# EAGLE design IDC-RJ45_connector_v1 (EAGLE 7.6.0)
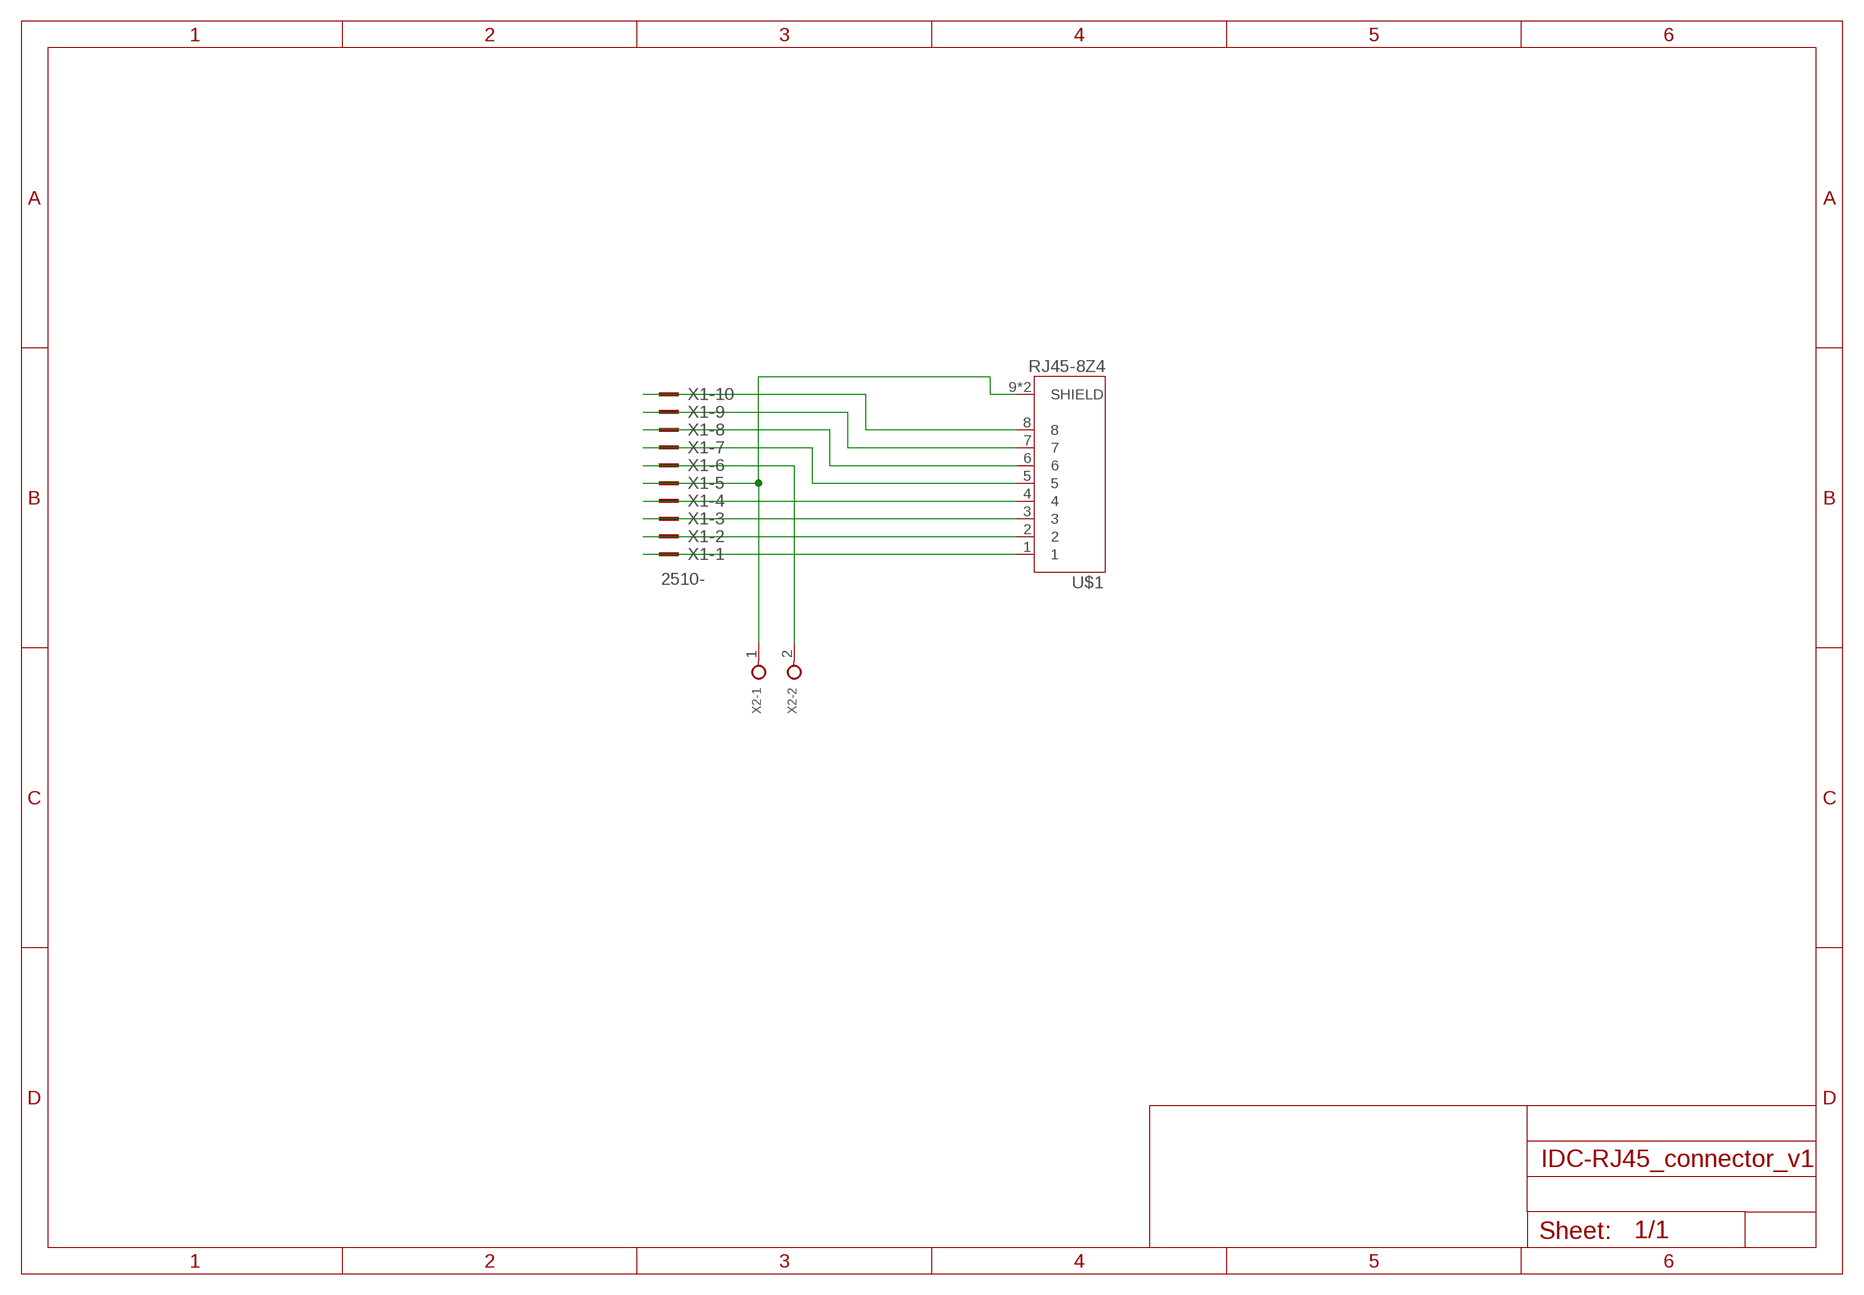
[diagram p0: schematic, sheet 1]

## Parts
U$1  RJ45-8Z4  [TE_RJ45-8Z4]
X1  2510-  [PAK100/2500-10]
X2  TERMINAL-5MM-2POLE  [TERMINAL_2P_5MM]

## Nets
GND [pwr]: U$1.9(SHIELD) U$1.10(SHIELD) X1.5 X2.1
N$1: U$1.1 X1.1
N$2: U$1.2 X1.2
N$3: U$1.3 X1.3
N$4: U$1.4 X1.4
N$5: U$1.5 X1.7
N$6: U$1.6 X1.8
N$7: U$1.7 X1.9
N$8: U$1.8 X1.10
VCC [pwr]: X1.6 X2.2

## Library data of the parts
U$1 = Thomas:RJ45-8Z4: CONN MOD JACK 8P8C R/A SHIELDED Check availability <https://pricing.snapeda.com/parts/RJ45-8Z4/TE%20Connectivity/view-part?ref=eda>; AVAILABILITY: In Stock; DESCRIPTION: Jack Modular Connector 8p8c (RJ45, Ethernet) 90° Angle (Right) Shielded -; MF: TE Connectivity; MP: RJ45-8Z4; PACKAGE: None; PRICE: None; PURCHASE-URL: https://pricing.snapeda.com/search/part/RJ45-8Z4/?ref=eda
X1 = Thomas:2510-: 3M (TM) Pak 100 4-Wall Header Source: 3M; MF: 3M; MPN: 2510-6002UB; OC_FARNELL: 9838244; OC_NEWARK: 46F4725
X2 = Thomas:TERMINAL-5MM-2POLE: WAGO SCREW CLAMP; OC_FARNELL: unknown; OC_NEWARK: unknown

## Net classes
1 pwr: width 0.61 mm

## Board
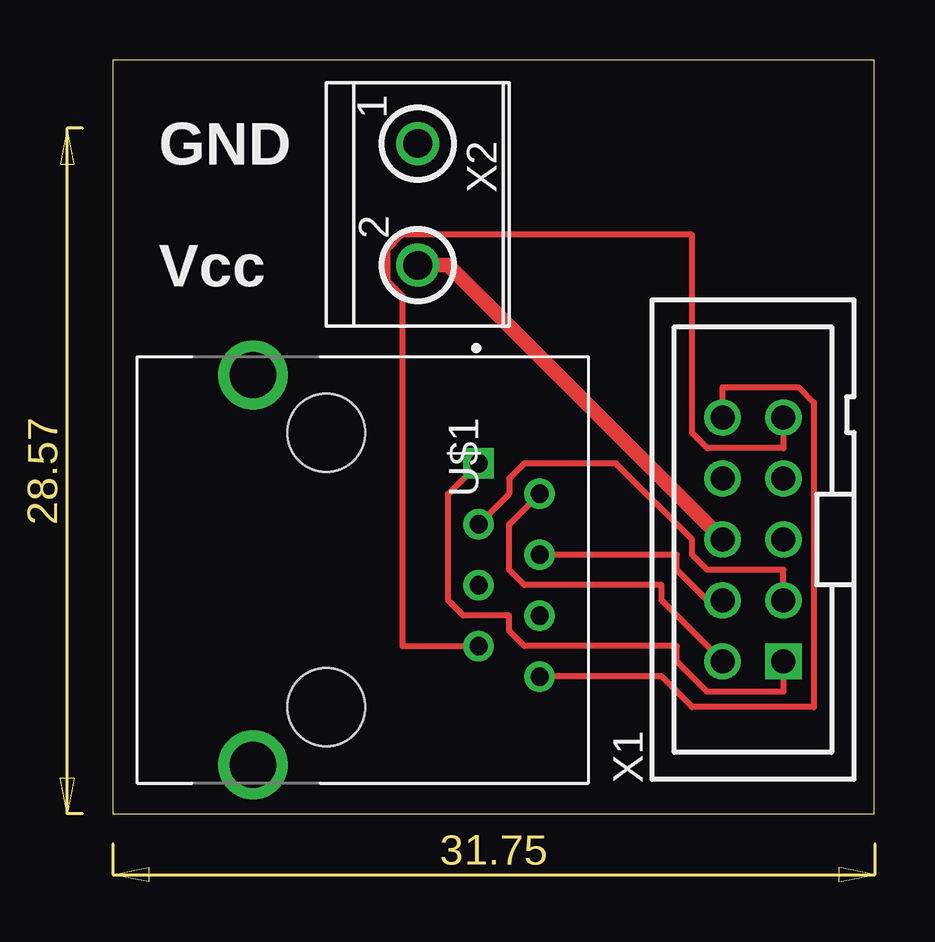
[diagram p1: board, top side]
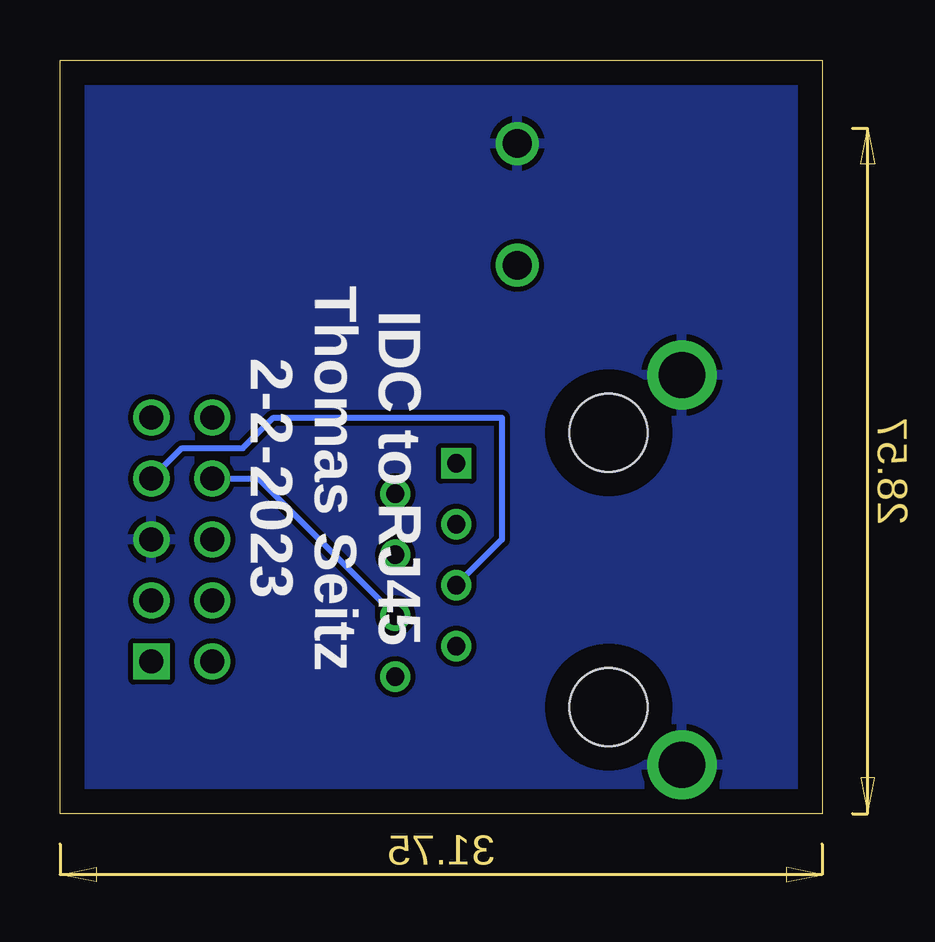
[diagram p2: board, bottom side, seen from below]

Size 31.73 x 31.42 mm. Coordinates in mm from the lower left corner, seen from the top.
Outline: 0,0 31.73,0 31.73,31.42 0,31.42 0,0
Copper layers (1*16): Top 0.035mm / dielectric 1.5mm / Bottom 0.035mm
Design rules "default": minimum track width 10mil, minimum drill 24mil, track to track 8mil, track to pad 8mil, pad to pad 8mil, via to via 8mil, smd to smd 8mil, copper to edge 40mil, drill to drill 8mil, minimum pad ring 10mil, minimum via ring 8mil, stop-mask expansion 4mil, vias tented up to drill 0mil, thermal gap 10mil

### Footprints (pad centres in the part's own frame; a part is rotated, then mirrored left to right if it is on the bottom)
TE_RJ45-8Z4 = drill 0.76 square: 1 -4.445,6.35 | drill 0.76: 2 -3.175,8.89; 3 -1.905,6.35; 4 -0.635,8.89; 5 0.635,6.35; 6 1.905,8.89; 7 3.175,6.35; 8 4.445,8.89 | drill 1.93: 9 -8.125,-3.05; 10 8.125,-3.05 | hole 3.25: 5.715,0; -5.715,0
PAK100/2500-10 = drill 1 pad 1.422 square: 1 -5.08,-1.27 | drill 1 pad 1.422: 2 -5.08,1.27; 3 -2.54,-1.27; 4 -2.54,1.27; 5 0,-1.27; 6 0,1.27; 7 2.54,-1.27; 8 2.54,1.27; 9 5.08,-1.27; 10 5.08,1.27
TERMINAL_2P_5MM = drill 1.194: 1 -2.54,0; 2 2.54,0

### Placement (x,y rotation side)
U$1  8.89,10.16 270 top
X1  26.67,11.43 90 top
X2  12.7,25.4 270 top

### Tracks (layer width: path | path; a pad name or v marks a point on that pad's centre or on a via)
GND
  pour Bottom: 0,31.75 31.75,31.75 31.75,0 0,0
N$1
  Top 0.254: U$1.1 13.97,13.34 13.97,8.89 14.61,8.26 16.51,8.26 16.51,7.62 17.14,6.99 23.5,6.99 23.5,6.35 24.77,5.08 27.94,5.08 X1.1
N$2
  Top 0.254: U$1.2 16.51,12.06 16.51,10.16 17.14,9.53 22.86,9.53 22.86,8.89 X1.2
N$3
  Top 0.254: U$1.3 16.51,13.34 16.51,13.97 17.14,14.61 20.95,14.61 24.13,11.43 24.13,10.79 24.77,10.16 27.94,10.16 X1.3
N$4
  Top 0.254: U$1.4 23.5,10.79 23.5,10.16 24.77,8.89 X1.4
N$5
  Bottom 0.254: U$1.5 13.34,11.43 13.34,16.51 22.86,16.51 24.13,15.24 26.67,15.24 X1.7
N$6
  Bottom 0.254: U$1.6 23.5,13.97 X1.8
N$7
  Top 0.254: U$1.7 12.06,6.99 12.06,21.59 11.43,22.23 11.43,23.5 12.06,24.13 24.13,24.13 24.13,15.88 24.77,15.24 27.94,15.24 X1.9
N$8
  Top 0.254: U$1.8 22.86,5.71 24.13,4.45 29.21,4.45 29.21,17.14 28.57,17.78 25.4,17.78 X1.10
VCC
  Top 0.61: X1.6 13.97,22.86 X2.2

### Text on the board
tPlace: GND | Vcc
bPlace: IDC to RJ45 / Thomas Seitz / 2-2-2023